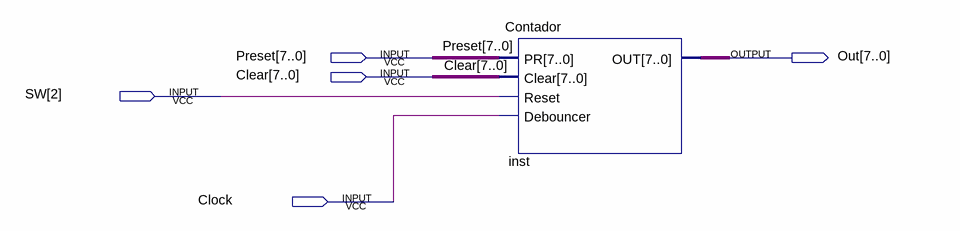
[diagram p0: schematic sheet]
// Quartus schematic debugger.bdf as structural Verilog: 1 symbols, 5 pins
module debugger (
  input  [7:0] Preset,
  input  [7:0] Clear,
  input  [2:2] SW,
  input  Clock,
  output [7:0] Out
);

  Contador inst (.PR(Preset), .Clear(Clear), .Reset(SW[2]), .Debouncer(Clock), .OUT(Out));
endmodule
